# Altium project SmartWatchFinalProject.PrjPcb
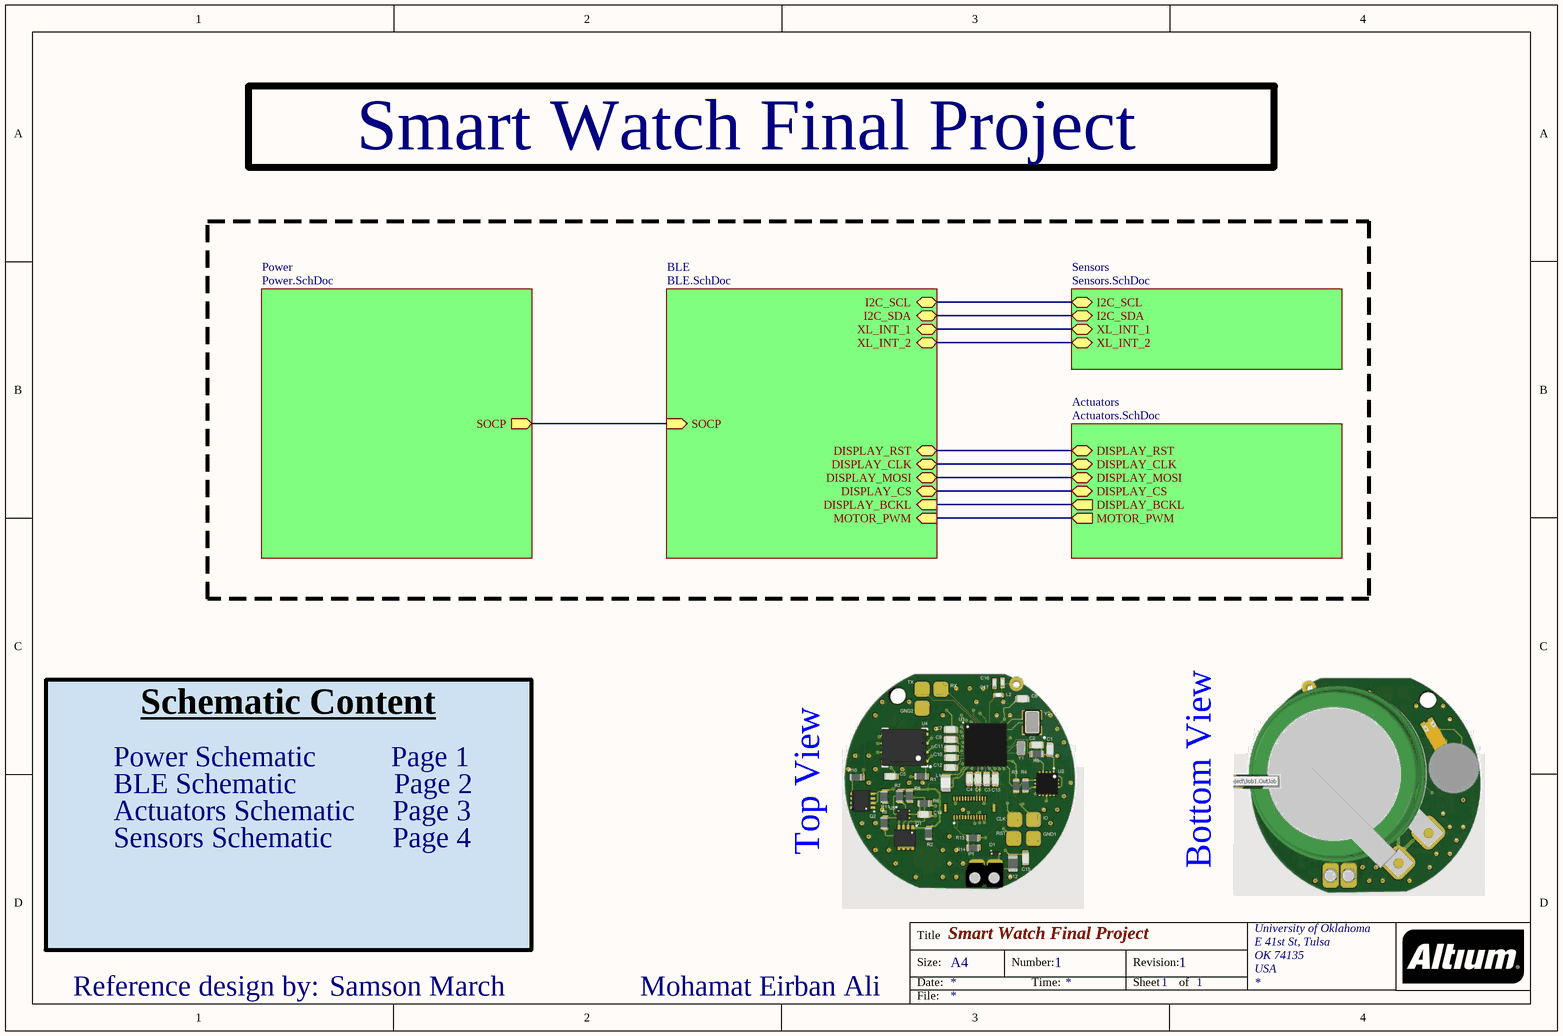
[diagram p0: Main.SchDoc]
Address: 4502 E 41st St; Address12: Tulsa, OK 74135; Author: Mohamat Eirban Ali; DesignStatus: Checked; Organization: University of Oklahoma; Original Designer: Samson March; Project Name12: Smart Watch V5; Project Title: Smart Watch Final Project
5 sheets, 54 parts. Net scope: hierarchical (ports join the sheet entries above them; power ports are global).
Board file: SmartWatchFinalProject.PcbDoc
Sheets:
  Main.SchDoc
    Power = Power.SchDoc
    BLE = BLE.SchDoc
    Sensors = Sensors.SchDoc
    Actuators = Actuators.SchDoc

## Sheet Main.SchDoc: Smart Watch Final Project
size A4; Author: Mohamat Eirban Ali; CompanyName: University of Oklahoma; Organization: University of Oklahoma; Address1: E 41st St, Tulsa; Address2: OK 74135; Address3: USA; DocumentNumber: 1; Revision: 1; SheetNumber: 1; SheetTotal: 1; Project Name: Smart Watch V5; Design Status: Checked

### Sub-sheets
Actuators = Actuators.SchDoc: DISPLAY_RST (bidir), DISPLAY_CLK (bidir), DISPLAY_MOSI (bidir), DISPLAY_CS (bidir), DISPLAY_BCKL (out), MOTOR_PWM (out)
BLE = BLE.SchDoc: SOCP (in), I2C_SCL (bidir), I2C_SDA (bidir), XL_INT_1 (bidir), XL_INT_2 (bidir), DISPLAY_RST (bidir), DISPLAY_CLK (bidir), DISPLAY_MOSI (bidir), DISPLAY_CS (bidir), DISPLAY_BCKL (in), MOTOR_PWM (in)
Power = Power.SchDoc: SOCP (out)
Sensors = Sensors.SchDoc: I2C_SCL (bidir), I2C_SDA (bidir), XL_INT_1 (bidir), XL_INT_2 (bidir)

### Nets
DISPLAY_BCKL: sheet BLE/DISPLAY_BCKL, sheet Actuators/DISPLAY_BCKL
DISPLAY_CLK: sheet BLE/DISPLAY_CLK, sheet Actuators/DISPLAY_CLK
DISPLAY_CS: sheet BLE/DISPLAY_CS, sheet Actuators/DISPLAY_CS
DISPLAY_MOSI: sheet BLE/DISPLAY_MOSI, sheet Actuators/DISPLAY_MOSI
DISPLAY_RST: sheet BLE/DISPLAY_RST, sheet Actuators/DISPLAY_RST
I2C_SCL: sheet BLE/I2C_SCL, sheet Sensors/I2C_SCL
I2C_SDA: sheet BLE/I2C_SDA, sheet Sensors/I2C_SDA
MOTOR_PWM: sheet BLE/MOTOR_PWM, sheet Actuators/MOTOR_PWM
SOCP: sheet Power/SOCP, sheet BLE/SOCP
XL_INT_1: sheet BLE/XL_INT_1, sheet Sensors/XL_INT_1
XL_INT_2: sheet BLE/XL_INT_2, sheet Sensors/XL_INT_2

### Notes on the sheet
- Power Schematic          Page 1
- BLE Schematic             Page 2
- Actuators Schematic     Page 3
- Sensors Schematic        Page 4
- Top View
- Bottom View
- Schematic Content
- Reference design by:
- Title
- Size:
- Date:
- A4
- Number:
- Time:
- Revision:
- Sheet
- of
- File:

## Sheet Power.SchDoc: =Project Title
size A4; Author: Mohamat Eirban Ali; Organization: University of Oklahoma; Address1: 4502 E 41st St; Address2: Tulsa, OK 74135; DocumentNumber: 2; Revision: 1; SheetNumber: 1; SheetTotal: 4
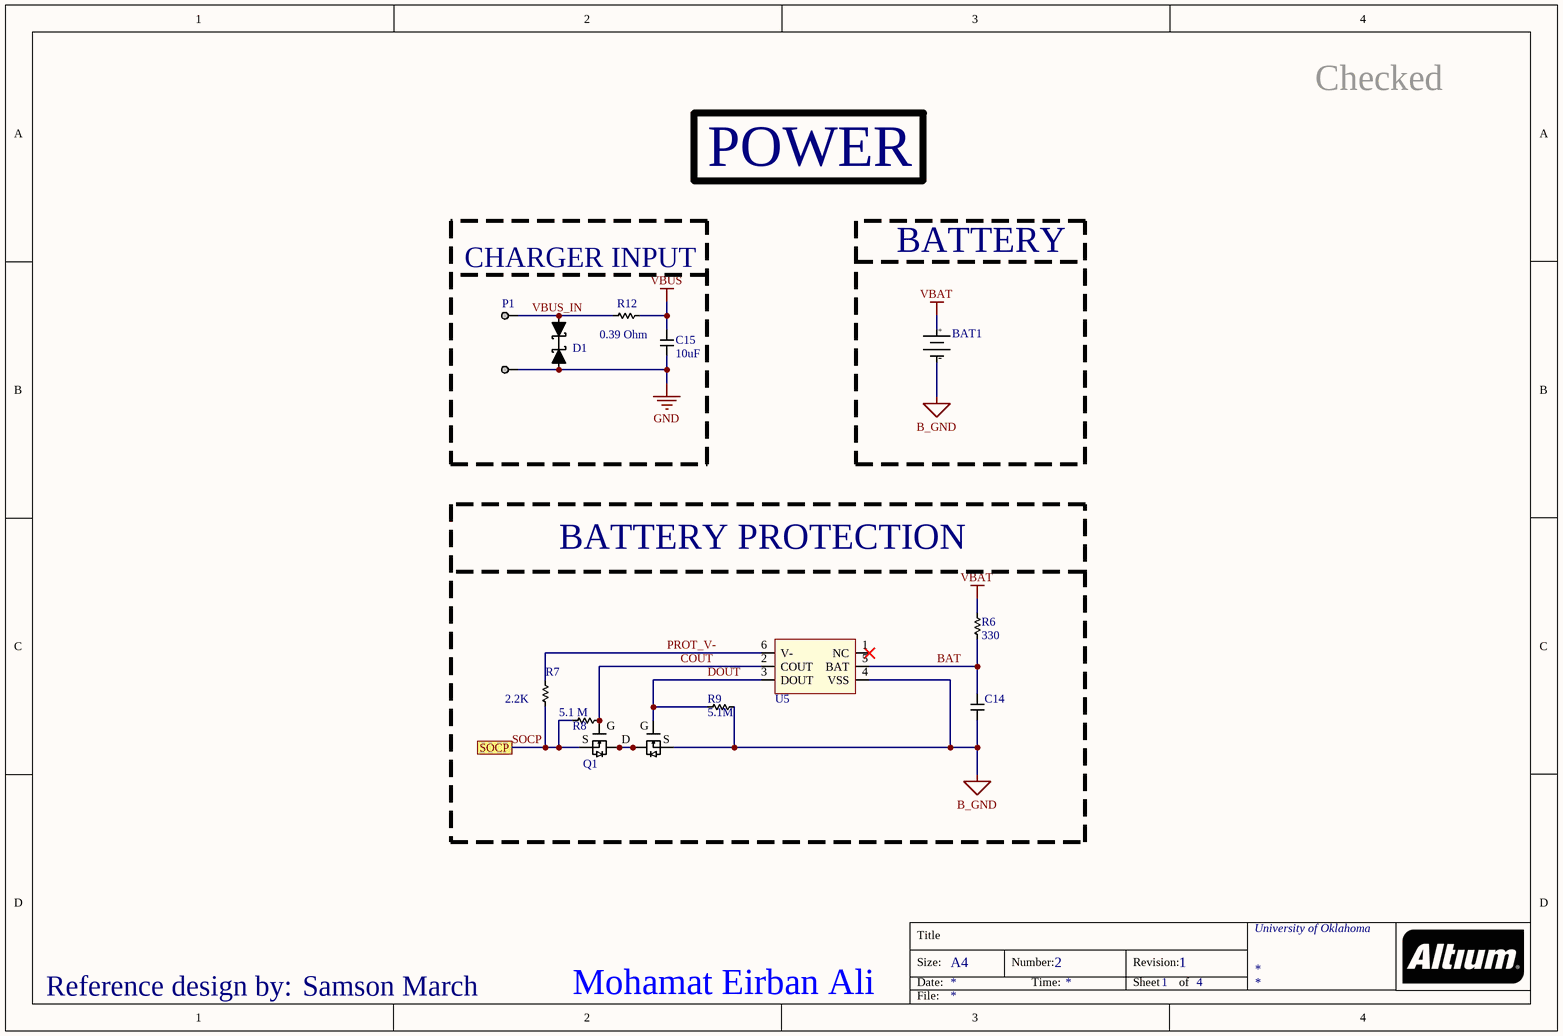
[diagram p1: Power.SchDoc]

### Parts
BAT1  (no value)  [RJD2430C1ST1]
C14  (no value)  [CAP_0603_HIGH]
C15  10uF  [CAP_0603_HIGH]
D1  (no value)  [ESD9B5.0ST5G]
P1  (no value)  [800-10-002-30-507101]
Q1  (no value)  [ECH8693R-TL-W]
R6  330  [RES_0603_HIGH]
R7  2.2K  [RES_0603_HIGH]
R8  5.1 M  [RES_0603_HIGH]
R9  5.1M  [RES_0603_HIGH]
R12  0.39 Ohm  [RES_0805_HIGH]
U5  (no value)  [BQ29700DSER]

### Blocks framed on the sheet
CHARGER INPUT: C15 D1 P1 R12
BATTERY: BAT1
BATTERY PROTECTION: C14 Q1 R6-R9 U5

### Ports
SOCP

### Nets
B_GND: BAT1.2(-) C14.2 Q1.3(S2) R9.1 U5.4(VSS)
GND: C15.2 D1.1 P1.2
VBAT: BAT1.1(+) R6.1
VBUS: C15.1 R12.2
BAT: C14.1 R6.2 U5.5(BAT)
COUT: Q1.2(G1) R8.1 U5.2(COUT)
DOUT: Q1.4(G2) R9.2 U5.3(DOUT)
PROT_V-: R7.1 U5.6(V-)
SOCP: Q1.1(S1) R7.2 R8.2 ; port SOCP
VBUS_IN: D1.2 P1.1 R12.1
NetQ1_5: Q1.5(D) Q1.6(D) Q1.7(D) Q1.8(D)

Not connected (* = marked no-connect by the designer): U5 1(NC)*

### Notes on the sheet
- POWER
- Reference design by:
- Title
- Size:
- Date:
- A4
- Number:
- Time:
- Revision:
- Sheet
- of
- File:
- (in symbol ECH8693R-TL-W) G; S

### Library data of the parts
BAT1 = RJD2430C1ST1: Coin, 24.5mm 3.7V Lithium-Ion Battery Rechargeable (Secondary) 110mAh; Manufacturer 1: CDE Illinois Capacitor; Supplier 1: Digi-Key; Supplier Part Number 1: 1572-1630-ND; Manufacturer Part Number 1: RJD2430C1ST1; Stock 1: 39; Pricing 1: 1=11.09000, 30=8.60200, 60=8.11500, 120=7.68217, 270=7.24941, 510=7.03300 (USD); RoHS: No
C14 = Capacitor_0603: 0603 Capacitor; Manufacturer 1: TDK; Manufacturer Part Number 1: CGA3E2X7R1H104K080AA; Capacitance: 100nF; Tolerance: 10%; Voltage Rating: 50V; Dielectric: X7R; Supplier 1: Digi-Key; Supplier Part Number 1: 445-5666-6-ND; Stock 1: 11655935; Pricing 1: 1=0.10000, 10=0.07500, 100=0.03350, 500=0.02390, 1000=0.01878 (USD); RoHS: Yes; Mount: Surface Mount; Case/Package: 0603; Weight: 7.1E-05oz; Case Code (Imperial): 0603; Case Code (Metric): 1608; Min Operating Temperature: -55°C; Max Operating Temperature: 125°C; Packaging: Tape and Reel; Voltage Rating (DC): 50V; Termination: SMD/SMT; Package Quantity: 1; Voltage: 50V; Composition: Ceramic; Length: 1.6mm; Height: 0.8mm; Width: 0.8mm; Depth: 0.8mm; Thickness: 0.035inch; Ratings: AEC-Q200; Radiation Hardening: No; REACH SVHC: No SVHC; Lead Free: Lead Free; ComponentLink1URL: https://datasheet.ciiva.com/24216/cga3e2x7r1h104k080aa-266291-24216208.pdf?src-supplier=Mouser; ComponentLink1Description: https://datasheet.ciiva.com/24216/cga3e2x7r1h104k080aa-266291-24216208.pdf?src-supplier=Mouser; ComponentLink2URL: https://datasheet.ciiva.com/15192/getdatasheetpartid-715867-15192412.pdf?src-supplier=Verical; ComponentLink2Description: https://datasheet.ciiva.com/15192/getdatasheetpartid-715867-15192412.pdf?src-supplier=Verical; ComponentLink3URL: https://datasheet.ciiva.com/16500/mlccspec-automotive-general-midvoltage-en-16500693.pdf?src-supplier=Future+Electronics; ComponentLink3Description: https://datasheet.ciiva.com/16500/mlccspec-automotive-general-midvoltage-en-16500693.pdf?src-supplier=Future+Electronics; ComponentLink4URL: https://datasheet.ciiva.com/22725/1735392-22725642.pdf?src-supplier=Element14; ComponentLink4Description: https://datasheet.ciiva.com/22725/1735392-22725642.pdf?src-supplier=Element14; ComponentLink5URL: https://datasheet.ciiva.com/23803/1936565-23803084.pdf?src-supplier=Newark; ComponentLink5Description: https://datasheet.ciiva.com/23803/1936565-23803084.pdf?src-supplier=Newark; ComponentLink6URL: https://datasheet.ciiva.com/46385/1735392-46385708.pdf?src-supplier=Element14; ComponentLink6Description: https://datasheet.ciiva.com/46385/1735392-46385708.pdf?src-supplier=Element14
C15 = Capacitor_0603_1: 0603 Capacitor
D1 = ESD9B5.0ST5G: TVS DIODE 5V SOD923; Manufacturer 1: ON Semiconductor; Min Breakdown Voltage: 5.8V; Power Line Protection: No; Clamping Voltage: 12.5V; Peak Pulse Power: 300mW; Capacitance: 15pF; Number of Channels: 1; Peak Pulse Current: 1A; Direction: Bidirectional; Leakage Current: 1uA; Element Configuration: Single; Test Current: 1mA; ESD Protection: Yes; Max Breakdown Voltage: 7.8V; Supplier 1: Digi-Key; Supplier Part Number 1: ESD9B5.0ST5GOSCT-ND; Manufacturer Part Number 1: ESD9B5.0ST5G; Stock 1: 624705; Pricing 1: 1=0.14000, 10=0.13100, 100=0.07120, 500=0.04380, 1000=0.02986 (USD); RoHS: Yes; Case/Package: SOD-923-2; Number of Pins: 2; Contact Plating: Tin; Min Operating Temperature: -55°C; Max Operating Temperature: 150°C; Packaging: Tape and Reel; Reverse Standoff Voltage: 5V; Composition: Zener; Package Quantity: 1; Breakdown Voltage: 5.8V; Termination: SMD/SMT; Operating Supply Voltage: 5V; Max Power Dissipation: 300mW; Working Voltage: 5V; Polarity: Bidirectional; Max Reverse Leakage Current: 1uA; Number of Lines: 1; Reverse Breakdown Voltage: 5.8V; Number of Elements: 1; Number of Bidirectional Channels: 1; Max Surge Current: 1A; Length: 0.8mm; Height: 0.4mm; Depth: 0.6mm; Width: 0.65mm; Radiation Hardening: No; Lead Free: Lead Free; Halogen Free: Halogen Free; REACH SVHC: No SVHC; ComponentLink1URL: https://datasheet.ciiva.com/1219/1596367-1219274.pdf?src-supplier=Newark; ComponentLink1Description: https://datasheet.ciiva.com/1219/1596367-1219274.pdf?src-supplier=Newark; ComponentLink2URL: https://datasheet.ciiva.com/15143/getdatasheetpartid-148214-15143780.pdf?src-supplier=Verical; ComponentLink2Description: https://datasheet.ciiva.com/15143/getdatasheetpartid-148214-15143780.pdf?src-supplier=Verical; ComponentLink3URL: https://datasheet.ciiva.com/3304/esd9b-d-3304010.pdf?src-supplier=Avnet; ComponentLink3Description: https://datasheet.ciiva.com/3304/esd9b-d-3304010.pdf?src-supplier=Avnet; ComponentLink4URL: https://datasheet.ciiva.com/339/esd9b-d-339708.pdf?src-supplier=Digi-Key; ComponentLink4Description: https://datasheet.ciiva.com/339/esd9b-d-339708.pdf?src-supplier=Digi-Key; ComponentLink5URL: https://datasheet.ciiva.com/339/esd9b-d-339707.pdf?src-supplier=Digi-Key; ComponentLink5Description: https://datasheet.ciiva.com/339/esd9b-d-339707.pdf?src-supplier=Digi-Key; ComponentLink6URL: https://datasheet.ciiva.com/4508/esd9b-d-4508620.pdf?src-supplier=Mouser; ComponentLink6Description: https://datasheet.ciiva.com/4508/esd9b-d-4508620.pdf?src-supplier=Mouser
P1 = 800-10-002-30-507101: 2 Position Spring Mating Target Connector Surface Mount; Manufacturer 1: Preci-Dip; Gender: Male; Current Rating: 3.5A; Voltage Rating: 150V; Number of Contacts: 2; Max Voltage Rating (AC): 100V; Pitch: 2.54mm; Supplier 1: Digi-Key; Supplier Part Number 1: 1212-1446-ND; Manufacturer Part Number 1: 800-10-002-30-507101; Stock 1: 803; Pricing 1: 1=0.47000, 10=0.44500, 25=0.40000, 50=0.35560, 100=0.34080, 250=0.31116, 500=0.29634, 1000=0.24448, 2500=0.22226 (USD); RoHS: Yes; Mount: Surface Mount; Contact Material: Brass; Contact Plating: Gold; Material: Brass; Housing Material: Polychlorinated; Housing Color: Black; Min Operating Temperature: -55°C; Max Operating Temperature: 125°C; Number of Rows: 1; Packaging: Bulk; Max Current Rating: 3.5A; Package Quantity: 1710; Termination: Solder; Orientation: Straight; Length: 5.08mm; Height: 4mm; Depth: 2.54mm; ComponentLink1URL: https://datasheet.ciiva.com/11750/0900766b80e0c4e6-11750532.pdf?src-supplier=RSComponents; ComponentLink1Description: https://datasheet.ciiva.com/11750/0900766b80e0c4e6-11750532.pdf?src-supplier=RSComponents; ComponentLink2URL: https://datasheet.ciiva.com/18468/catalog-18468028.pdf?src-supplier=Digi-Key; ComponentLink2Description: https://datasheet.ciiva.com/18468/catalog-18468028.pdf?src-supplier=Digi-Key
Q1 = ECH8693R-TL-W: Mosfet Array 2 N-Channel (Dual) Common Drain 24V 14A 1.4W Surface Mount SOT-28FL/ECH8; Manufacturer 1: ON Semiconductor; Rise Time: 525ns; Rds On Max: 7mR; Turn-On Delay Time: 545ns; Turn-Off Delay Time: 18650ns; Fall Time: 22200ns; Gate to Source Voltage (Vgs): 12.5V; Number of Channels: 2; Supplier 1: Digi-Key; Supplier Part Number 1: ECH8693R-TL-WOSCT-ND; Manufacturer Part Number 1: ECH8693R-TL-W; Stock 1: 2348; Pricing 1: 1=0.58000, 10=0.49500, 100=0.36940, 500=0.29028, 1000=0.22430 (USD); RoHS: Yes; Mount: Surface Mount; Case/Package: SMD/SMT; Number of Pins: 8; Contact Plating: Tin; Min Operating Temperature: -55°C; Max Operating Temperature: 150°C; Packaging: Tape and Reel; Drain to Source Voltage (Vdss): 24V; Continuous Drain Current (ID): 14A; Max Power Dissipation: 1.4W; Drain to Source Breakdown Voltage: 24V; Drain to Source Resistance: 7mR; Package Quantity: 3000; FET Type: 2 N-Channel; Radiation Hardening: No; Lead Free: Lead Free; ComponentLink1URL: https://datasheet.ciiva.com/30022/ech8693r-d-30022230.pdf?src-supplier=Avnet; ComponentLink1Description: https://datasheet.ciiva.com/30022/ech8693r-d-30022230.pdf?src-supplier=Avnet
R6 = Resistor_0603_2: 0603 Resistor
R7 = Resistor_0603_1: 0603 Resistor
R8 R9 = Resistor_0603: 0603 Resistor; Manufacturer 1: Panasonic; Manufacturer Part Number 1: ERJ3GEYJ515V; Resistance: 5.1MR; Tolerance: 5%; Temperature Coefficient: 150ppm/°C; Power Rating: 100mW; Voltage Rating: 75V; Voltage Rating (DC): 50V; Supplier 1: Digi-Key; Supplier Part Number 1: P5.1MGCT-ND; Stock 1: 168591; Pricing 1: 1=0.10000, 10=0.04300, 100=0.01760, 1000=0.00791, 2500=0.00686 (USD); RoHS: Yes; Mount: Surface Mount; Case/Package: 0603; Case Code (Metric): 1608; Case Code (Imperial): 0603; Contact Plating: Tin; Min Operating Temperature: -55°C; Max Operating Temperature: 155°C; Packaging: Tape and Reel; Composition: Thick Film; Number of Terminations: 2; Max Power Dissipation: 100mW; Package Quantity: 1; Termination: SMD/SMT; Features: Automotive AEC-Q200; Military Standard: Not; Length: 1.6mm; Height: 0.45mm; Width: 0.031inch; Depth: 0.8mm; Lead Free: Lead Free; REACH SVHC: No SVHC; ComponentLink1URL: https://datasheet.ciiva.com/24072/aoa0000ce1-37422-24072359.pdf?src-supplier=Mouser; ComponentLink1Description: https://datasheet.ciiva.com/24072/aoa0000ce1-37422-24072359.pdf?src-supplier=Mouser; ComponentLink2URL: https://datasheet.ciiva.com/9195/aoa0000ce1-9195547.pdf?src-supplier=Avnet; ComponentLink2Description: https://datasheet.ciiva.com/9195/aoa0000ce1-9195547.pdf?src-supplier=Avnet; ComponentLink3URL: https://datasheet.ciiva.com/43460/1500035-43460797.pdf?src-supplier=Farnell; ComponentLink3Description: https://datasheet.ciiva.com/43460/1500035-43460797.pdf?src-supplier=Farnell; ComponentLink4URL: https://datasheet.ciiva.com/46448/1500035-46448447.pdf?src-supplier=Element14; ComponentLink4Description: https://datasheet.ciiva.com/46448/1500035-46448447.pdf?src-supplier=Element14
R12 = Resistor_0805: 0805 Resistor
U5 = BQ29700DSER: Battery Battery Protection IC Lithium-Ion/Polymer 6-WSON (1.5x1.5); Manufacturer 1: Texas Instruments; Number of Cells: 1; Fault Protection: Over Current; Operating Supply Voltage: 8V; Supplier 1: Digi-Key; Supplier Part Number 1: 296-43985-1-ND; Manufacturer Part Number 1: BQ29700DSER; Stock 1: 54841; Pricing 1: 1=0.69000, 10=0.60800, 100=0.46650, 500=0.36874, 1000=0.29499 (USD); RoHS: Yes; Mount: Surface Mount; Number of Pins: 6; Weight: 0.000342oz; Contact Plating: Gold; Min Operating Temperature: -40°C; Max Operating Temperature: 85°C; Packaging: Tape and Reel; Package Quantity: 3000; Lead Free: Lead Free; ComponentLink1URL: http://www.ti.com/general/docs/lit/getliterature.tsp?genericPartNumber=BQ2970&amp;&amp;fileType=pdf&src-supplier=Avnet+Asia; ComponentLink1Description: http://www.ti.com/general/docs/lit/getliterature.tsp?genericPartNumber=BQ2970&amp;&amp;fileType=pdf&src-supplier=Avnet+Asia; ComponentLink2URL: http://www.ti.com/general/docs/lit/getliterature.tsp?genericPartNumber=BQ2970&&fileType=pdf&src-supplier=Avnet; ComponentLink2Description: http://www.ti.com/general/docs/lit/getliterature.tsp?genericPartNumber=BQ2970&&fileType=pdf&src-supplier=Avnet; ComponentLink3URL: http://www.ti.com/lit/gpn/bq2970?src-supplier=Mouser; ComponentLink3Description: http://www.ti.com/lit/gpn/bq2970?src-supplier=Mouser; ComponentLink4URL: http://www.ti.com/lit/ds/symlink/bq2971.pdf?src-supplier=Digi-Key; ComponentLink4Description: http://www.ti.com/lit/ds/symlink/bq2971.pdf?src-supplier=Digi-Key

## Sheet BLE.SchDoc: =Project Title
size A4; Organization: University of Oklahoma; Address1: 4502 E 41st St; Address2: Tulsa, OK 74135; DocumentNumber: 3; Revision: 1; SheetNumber: 2; SheetTotal: 4
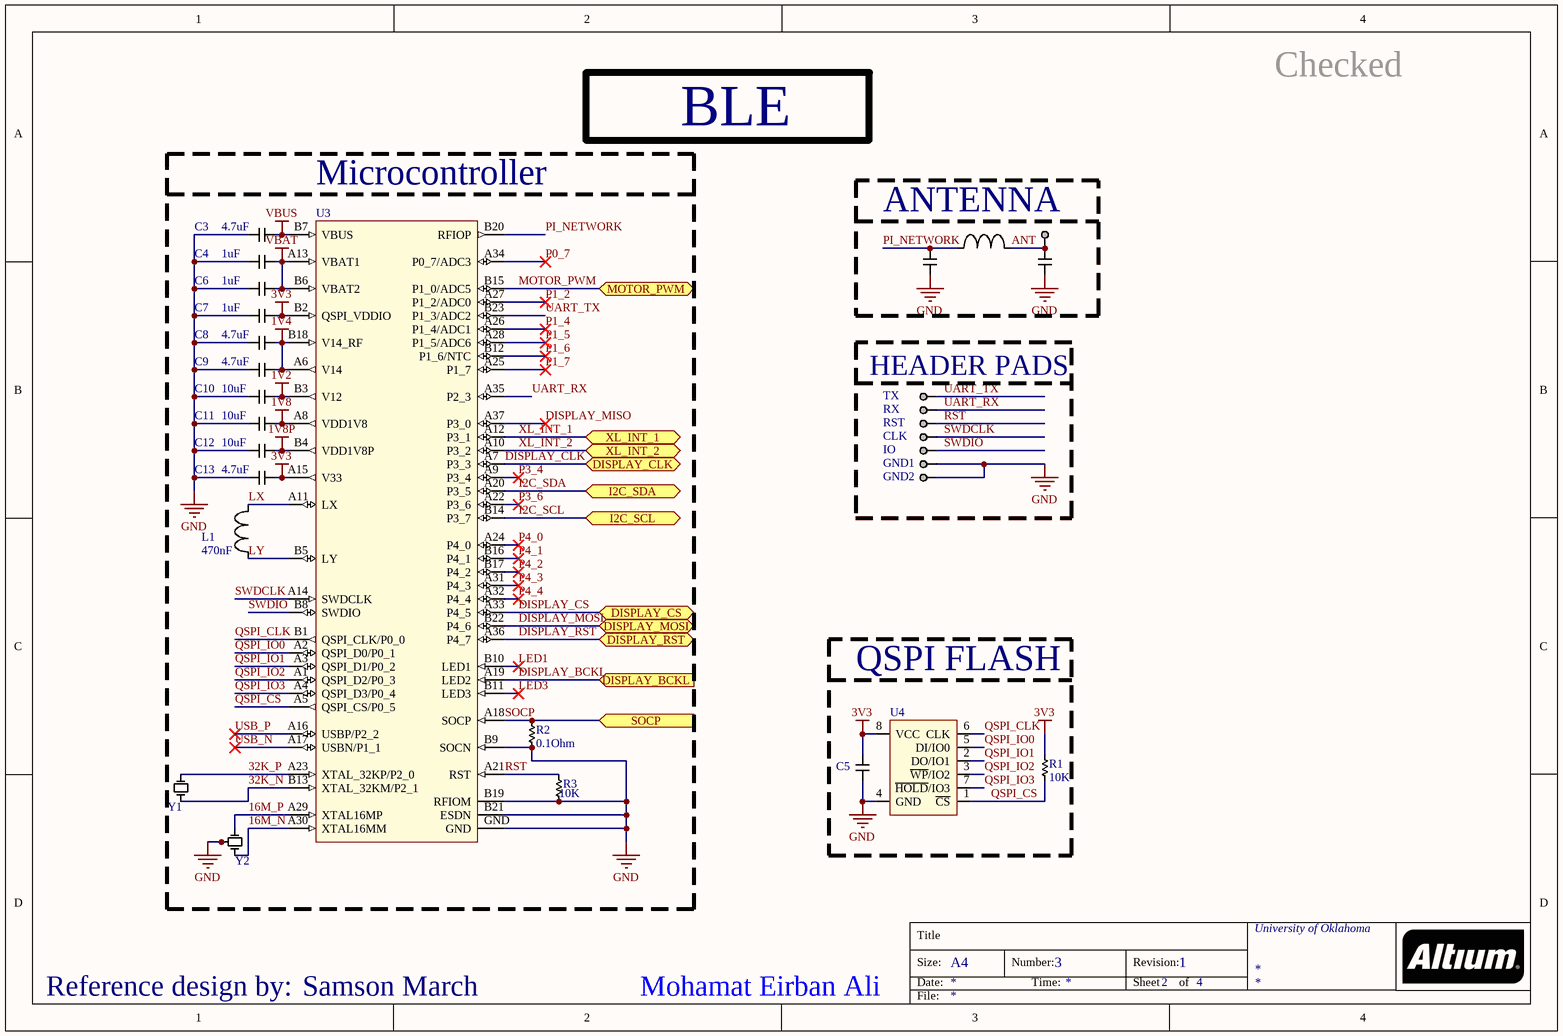
[diagram p2: BLE.SchDoc]

### Parts
ANT1  (no value)  [0.1" Header]  (no BOM)
C3  4.7uF  [CAP_0603_HIGH]
C4  1uF  [CAP_0603_HIGH]
C5  (no value)  [CAP_0603_HIGH]
C6  1uF  [CAP_0603_HIGH]
C7  1uF  [CAP_0603_HIGH]
C8  4.7uF  [CAP_0603_HIGH]
C9  4.7uF  [CAP_0603_HIGH]
C10  10uF  [CAP_0603_HIGH]
C11  10uF  [CAP_0603_HIGH]
C12  10uF  [CAP_0603_HIGH]
C13  4.7uF  [CAP_0603_HIGH]
C16  (no value)  [CAP_0402_MEDIUM]  (no BOM)
C17  (no value)  [CAP_0402_MEDIUM]  (no BOM)
CLK  (no value)  [0.1" Pad]  (no BOM)
GND1  (no value)  [0.1" Pad]  (no BOM)
GND2  (no value)  [0.1" Pad]  (no BOM)
IO  (no value)  [0.1" Pad]  (no BOM)
L1  value 470nF  [IND_0805_HIGH]
L2  (no value)  [IND_0402_MEDIUM]  (no BOM)
R1  10K  [RES_0603_HIGH]
R2  0.1Ohm  [RES_0603_HIGH]
R3  10K  [RES_0603_HIGH]
RST  (no value)  [0.1" Pad]  (no BOM)
RX  (no value)  [0.1" Pad]  (no BOM)
TX  (no value)  [0.1" Pad]  (no BOM)
U3  (no value)  [DA14683]
U4  (no value)  [W25Q128JVPIQ]
Y1  (no value)  [9HT11-32.768KDZB-T]
Y2  (no value)  [7M-16.000MEEQ-T]

### Blocks framed on the sheet
BLE: C3 C4 C6-C13 L1 R2 R3 U3 Y1 Y2
ANTENNA: ANT1 C16 C17 L2
HEADER PADS: CLK GND1 GND2 IO RST RX TX
QSPI FLASH: C5 R1 U4

### Ports
DISPLAY_BCKL (in), DISPLAY_CLK (bidir), DISPLAY_CS (bidir), DISPLAY_MOSI (bidir), DISPLAY_RST (bidir), I2C_SCL (bidir), I2C_SDA (bidir), MOTOR_PWM (bidir), SOCP (in), XL_INT_1 (bidir), XL_INT_2 (bidir)

### Nets
1V2: C10.1 U3.B3(V12)
1V4: C8.1 C9.1 U3.A6(V14) U3.B18(V14_RF)
1V8: C11.1 U3.A8(VDD1V8)
1V8P: C12.1 U3.B4(VDD1V8P)
3V3: C5.1 C7.1 C13.1 R1.2 U3.A15(V33) U3.B2(QSPI_VDDIO) U4.8(VCC)
GND: C3.2 C4.2 C5.2 C6.2 C7.2 C8.2 C9.2 C10.2 C11.2 C12.2 C13.2 C16.1 C17.1 GND1.1 GND2.1 R2.1 R3.1 U3.B9(SOCN) U3.B19(RFIOM) U3.B21(ESDN) U3.GND U4.4(GND) Y2.2 Y2.4
VBAT: C4.1 C6.1 U3.A13(VBAT1) U3.B6(VBAT2)
VBUS: C3.1 U3.B7(VBUS)
16M_N: U3.A30(XTAL16MM) Y2.3
16M_P: U3.A29(XTAL16MP) Y2.1
32K_N: U3.B13(XTAL_32KM/P2_1) Y1.1
32K_P: U3.A23(XTAL_32KP/P2_0) Y1.2
ANT: ANT1.1 C17.2 L2.1
DISPLAY_BCKL: U3.A19(LED2) ; port DISPLAY_BCKL
DISPLAY_CLK: U3.A7(P3_3) ; port DISPLAY_CLK
DISPLAY_CS: U3.A33(P4_5) ; port DISPLAY_CS
DISPLAY_MISO: U3.A37(P3_0)
DISPLAY_MOSI: U3.B22(P4_6) ; port DISPLAY_MOSI
DISPLAY_RST: U3.A36(P4_7) ; port DISPLAY_RST
I2C_SCL: U3.B14(P3_7) ; port I2C_SCL
I2C_SDA: U3.A20(P3_5) ; port I2C_SDA
LED1: U3.B10(LED1)
LED3: U3.B11(LED3)
LX: L1.2 U3.A11(LX)
LY: L1.1 U3.B5(LY)
MOTOR_PWM: U3.B15(P1_0/ADC5) ; port MOTOR_PWM
P0_7: U3.A34(P0_7/ADC3)
P1_2: U3.A27(P1_2/ADC0)
P1_4: U3.A26(P1_4/ADC1)
P1_5: U3.A28(P1_5/ADC6)
P1_6: U3.B12(P1_6/NTC)
P1_7: U3.A25(P1_7)
P3_4: U3.A9(P3_4)
P3_6: U3.A22(P3_6)
P4_0: U3.A24(P4_0)
P4_1: U3.B16(P4_1)
P4_2: U3.B17(P4_2)
P4_3: U3.A31(P4_3)
P4_4: U3.A32(P4_4)
PI_NETWORK: C16.2 L2.2 U3.B20(RFIOP)
QSPI_CLK: U3.B1(QSPI_CLK/P0_0) U4.6(CLK)
QSPI_CS: R1.1 U3.A5(QSPI_CS/P0_5) U4.1(~{CS})
QSPI_IO0: U3.A2(QSPI_D0/P0_1) U4.5(DI/IO0)
QSPI_IO1: U3.A3(QSPI_D1/P0_2) U4.2(DO/IO1)
QSPI_IO2: U3.A1(QSPI_D2/P0_3) U4.3(~{WP}/IO2)
QSPI_IO3: U3.A4(QSPI_D3/P0_4) U4.7(~{HOLD}/IO3)
RST: R3.2 RST.1 U3.A21(RST)
SOCP: R2.2 U3.A18(SOCP) ; port SOCP
SWDCLK: CLK.1 U3.A14(SWDCLK)
SWDIO: IO.1 U3.B8(SWDIO)
UART_RX: RX.1 U3.A35(P2_3)
UART_TX: TX.1 U3.B23(P1_3/ADC2)
USB_N: U3.A17(USBN/P1_1)
USB_P: U3.A16(USBP/P2_2)
XL_INT_1: U3.A12(P3_1) ; port XL_INT_1
XL_INT_2: U3.A10(P3_2) ; port XL_INT_2

### Notes on the sheet
- Microcontroller
- Reference design by:
- Mohamat Eirban Ali
- Title
- Size:
- Date:
- A4
- Number:
- Time:
- Revision:
- Sheet
- of
- File:

### Library data of the parts
ANT1 = 0.1" Header
C3 C8 C9 C13 = Capacitor_0603_2: 0603 Capacitor
C4 C6 C7 = Capacitor_0603_3: 0603 Capacitor
C5 = Capacitor_0603: 0603 Capacitor
C10-C12 = Capacitor_0603_1: 0603 Capacitor
C16 C17 = Capacitor_0402: 0402 Capacitor
CLK GND1 GND2 IO RST RX TX = 0.1" Pad
L1 = Inductor_0805: Parameter 1: CKP2012; Parameter 2: NR47M-T; Parameter 3: *; Parameter 4: *
L2 = Inductor_0402
R1 R3 = Resistor_0603_3: 0603 Resistor
R2 = Resistor_0603_4: 0603 Resistor
U3 = DA14683: SmartBond DA14683 Single-chip high-security Bluetooth 5 solution with expandable memory; Manufacturer 1: Dialog Semiconductor; Manufacturer Part Number 1: DA14683-00000A92; Supplier 1: Digi-Key; Supplier Part Number 1: DA14683-00000A92CT-ND; Stock 1: 3880; Pricing 1: 1=5.12000, 10=4.57400, 25=4.11680, 100=3.75090, 250=3.38496, 500=3.03730, 1000=2.56158 (USD); RoHS: No
U4 = W25Q128JVPIQ: FLASH - NOR Memory IC 128Mb (16M x 8) SPI - Quad I/O, QPI, DTR 133MHz  8-WSON (6x5)
Y1 = 9HT11-32.768KDZB-T: 32.768kHz ±20ppm Crystal 6pF 90 kOhms 2-SMD, No Lead; Parameter 1: 9HT11; Parameter 2: -32.76; Parameter 3: 8KDZ; Parameter 4: B-T
Y2 = 7M-16.000MEEQ-T: 16MHz ±10ppm Crystal 10pF 80 Ohms 4-SMD, No Lead; Parameter 1: 7M-16; Parameter 2: .000M; Parameter 3: EEQ-T

## Sheet Sensors.SchDoc: =Project Title
size A4; Author: Mohamat Eirban Ali; Organization: University of Oklahoma; Address1: 4502 E 41st St; Address2: Tulsa, OK 74135; DocumentNumber: 5; Revision: 1; SheetNumber: 4; SheetTotal: 4
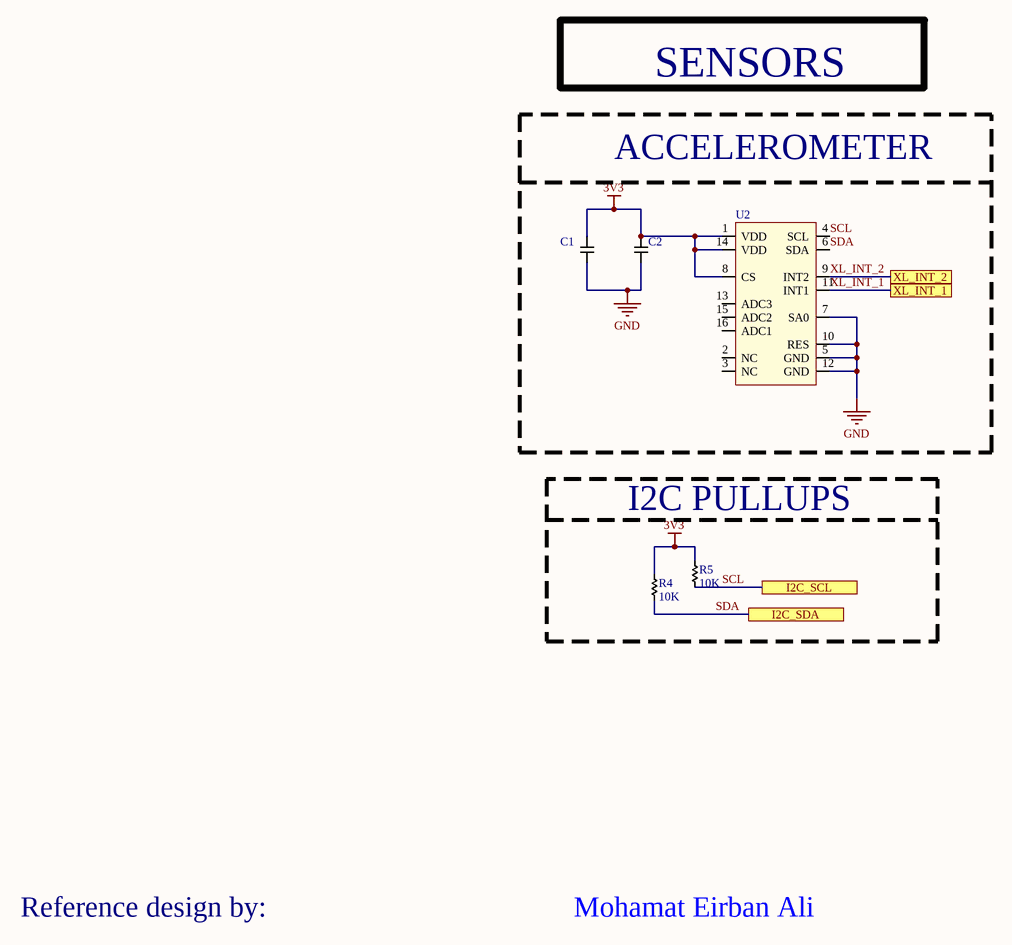
[diagram p3: Sensors.SchDoc]

### Parts
C1  (no value)  [CAP_0603_HIGH]
C2  (no value)  [CAP_0603_HIGH]
R4  10K  [RES_0603_HIGH]
R5  10K  [RES_0603_HIGH]
U2  (no value)  [LIS3DH]

### Blocks framed on the sheet
ACCELEROMETER: C1 C2 U2
I2C PULLUPS: R4 R5

### Ports
I2C_SCL, I2C_SDA, XL_INT_1, XL_INT_2

### Nets
3V3: C1.1 C2.1 R4.2 R5.2 U2.1(VDD) U2.8(CS) U2.14(VDD)
GND: C1.2 C2.2 U2.5(GND) U2.7(SA0) U2.10(RES) U2.12(GND)
SCL: R5.1 U2.4(SCL) ; port I2C_SCL  [project net I2C_SCL]
SDA: R4.1 U2.6(SDA) ; port I2C_SDA  [project net I2C_SDA]
XL_INT_1: U2.11(INT1) ; port XL_INT_1
XL_INT_2: U2.9(INT2) ; port XL_INT_2

Not connected (* = marked no-connect by the designer): U2 2(NC) 3(NC) 13(ADC3) 15(ADC2) 16(ADC1)

### Notes on the sheet
- SENSORS
- Reference design by:
- Mohamat Eirban Ali
- Title
- Size:
- Date:
- A4
- Number:
- Time:
- Revision:
- Sheet
- of
- File:

### Library data of the parts
C1 = Capacitor_0603: 0603 Capacitor; Manufacturer 1: Kyocera AVX; Manufacturer Part Number 1: F980J107MMAAXE; Capacitance: 100uF; Voltage Rating: 6.3V; ESR (Equivalent Series Resistance): 10R; Tolerance: 20%; Supplier 1: Digi-Key; Supplier Part Number 1: 478-9836-1-ND; Stock 1: 15476; Pricing 1: 1=0.67000, 10=0.49100, 100=0.33670, 500=0.26658, 1000=0.22448 (USD); RoHS: Yes; Mount: Surface Mount; Case/Package: 0603; Case Code (Metric): 1608; Case Code (Imperial): 0603; Min Operating Temperature: -55°C; Max Operating Temperature: 125°C; Packaging: Tape and Reel; Length: 0.063inch; Width: 0.033inch; Height - Seated (Max): 0.035inch; ComponentLink1URL: http://www.farnell.com/datasheets/2602422.pdf?src-supplier=Farnell; ComponentLink1Description: http://www.farnell.com/datasheets/2602422.pdf?src-supplier=Farnell; ComponentLink2URL: http://datasheets.avx.com/F98.pdf?src-supplier=Digi-Key; ComponentLink2Description: http://datasheets.avx.com/F98.pdf?src-supplier=Digi-Key
C2 = Capacitor_0603: 0603 Capacitor; Manufacturer 1: Murata; Manufacturer Part Number 1: GRM188R60J106ME47D; Material: Ceramic; Capacitance: 10uF; Tolerance: 20%; Voltage Rating: 6.3V; Dielectric: X5R; Supplier 1: Digi-Key; Supplier Part Number 1: 490-3896-1-ND; Stock 1: 20724673; Pricing 1: 1=0.37000, 10=0.25900, 100=0.15530, 500=0.11644, 1000=0.09833 (USD); RoHS: Yes; Mount: Surface Mount; Case/Package: 0603; Case Code (Metric): 1608; Case Code (Imperial): 0603; Min Operating Temperature: -55°C; Max Operating Temperature: 85°C; Packaging: Tape and Reel; Voltage Rating (DC): 6.3V; Package Quantity: 4000; Termination: SMD/SMT; Voltage: 6.3V; Length: 1.6mm; Height: 0.8mm; Width: 0.031inch; Depth: 0.8mm; Thickness: 0.035inch; Radiation Hardening: No; Lead Free: Lead Free; REACH SVHC: No SVHC; ComponentLink1URL: https://datasheet.ciiva.com/22776/1747457-22776418.pdf?src-supplier=Farnell; ComponentLink1Description: https://datasheet.ciiva.com/22776/1747457-22776418.pdf?src-supplier=Farnell; ComponentLink2URL: https://datasheet.ciiva.com/3777/10175grm188r60j106me4723-3777268.pdf?src-supplier=Arrow; ComponentLink2Description: https://datasheet.ciiva.com/3777/10175grm188r60j106me4723-3777268.pdf?src-supplier=Arrow; ComponentLink3URL: https://datasheet.ciiva.com/28584/415295-28584232.pdf?src-supplier=Element14; ComponentLink3Description: https://datasheet.ciiva.com/28584/415295-28584232.pdf?src-supplier=Element14; ComponentLink4URL: https://datasheet.ciiva.com/29202/450781-da-01-de-vs-chip-kond-0603-10-0-uf-20pr-6-3v-x5r-29202806.pdf?src-supplier=Conrad; ComponentLink4Description: https://datasheet.ciiva.com/29202/450781-da-01-de-vs-chip-kond-0603-10-0-uf-20pr-6-3v-x5r-29202806.pdf?src-supplier=Conrad; ComponentLink5URL: https://datasheet.ciiva.com/29199/454401-da-01-en-vs-kondensator-0603-29199677.pdf?src-supplier=Conrad; ComponentLink5Description: https://datasheet.ciiva.com/29199/454401-da-01-en-vs-kondensator-0603-29199677.pdf?src-supplier=Conrad; ComponentLink6URL: https://datasheet.ciiva.com/16373/l0005e-16373580.pdf?src-supplier=Future+Electronics; ComponentLink6Description: https://datasheet.ciiva.com/16373/l0005e-16373580.pdf?src-supplier=Future+Electronics; ComponentLink7URL: https://datasheet.ciiva.com/138/partnumbering-e-01-138658.pdf?src-supplier=Digi-Key; ComponentLink7Description: https://datasheet.ciiva.com/138/partnumbering-e-01-138658.pdf?src-supplier=Digi-Key; ComponentLink8URL: https://datasheet.ciiva.com/138/partnumbering-e-01-138659.pdf?src-supplier=Digi-Key; ComponentLink8Description: https://datasheet.ciiva.com/138/partnumbering-e-01-138659.pdf?src-supplier=Digi-Key; ComponentLink9URL: https://datasheet.ciiva.com/138/partnumbering-e-01-138660.pdf?src-supplier=Digi-Key; ComponentLink9Description: https://datasheet.ciiva.com/138/partnumbering-e-01-138660.pdf?src-supplier=Digi-Key; ComponentLink10URL: https://datasheet.ciiva.com/14116/grmseries-highdielectrictype-eng-14116428.pdf?src-supplier=Distrelec; ComponentLink10Description: https://datasheet.ciiva.com/14116/grmseries-highdielectrictype-eng-14116428.pdf?src-supplier=Distrelec
R4 R5 = Resistor_0603_3: 0603 Resistor
U2 = LIS3DH: LIS3DH ACCEL 2-16G I2C/SPI 16LGA

## Sheet Actuators.SchDoc: =Project Title
size A4; Author: Mohamat Eirban Ali; Organization: University of Oklahoma; Address1: 4502 E 41st St; Address2: Tulsa, OK 74135; DocumentNumber: 4; Revision: 1; SheetNumber: 3; SheetTotal: 4
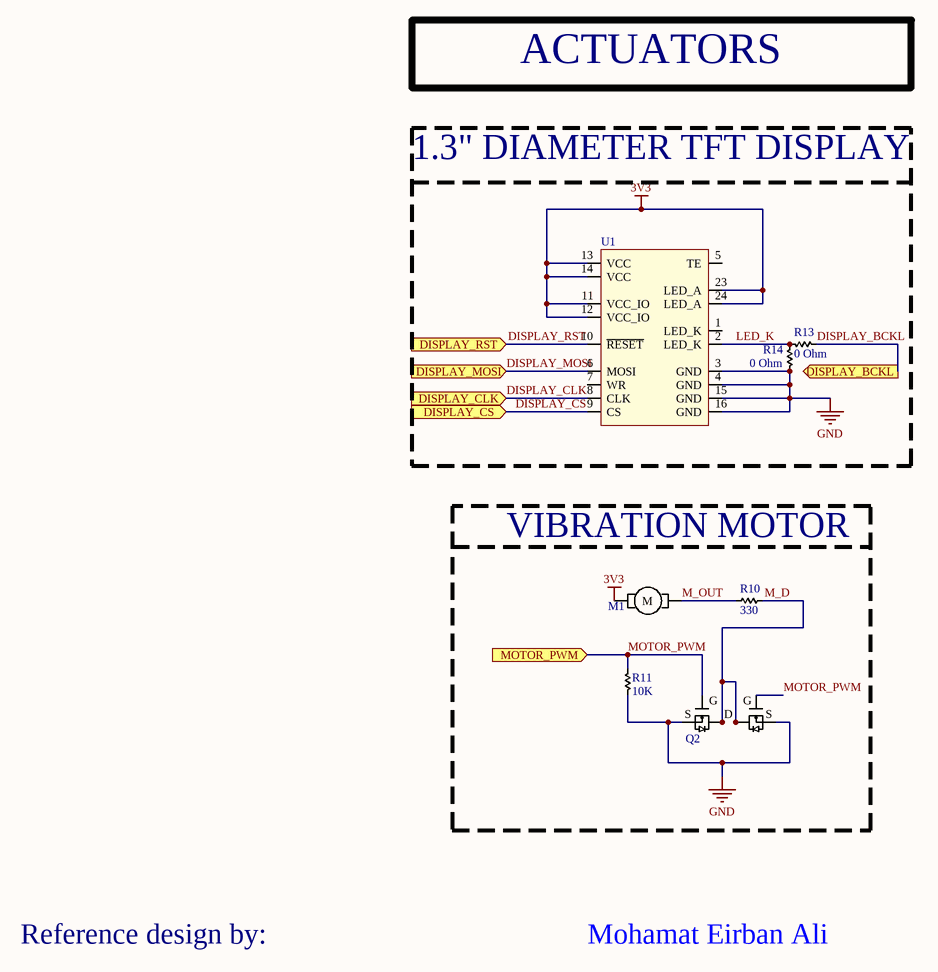
[diagram p4: Actuators.SchDoc]

### Parts
M1  (no value)  [C0720B001F]
Q2  (no value)  [ECH8693R-TL-W]
R10  330  [RES_0603_HIGH]
R11  10K  [RES_0603_HIGH]
R13  0 Ohm  [RES_0603_HIGH]
R14  0 Ohm  [RES_0603_HIGH]
U1  (no value)  [AML130A2402A]

### Blocks framed on the sheet
1.3" DIAMETER TFT DISPLAY: R13 R14 U1
VIBRATION MOTOR: M1 Q2 R10 R11

### Ports
DISPLAY_BCKL (out), DISPLAY_CLK (in), DISPLAY_CS (in), DISPLAY_MOSI (in), DISPLAY_RST (in), MOTOR_PWM (in)

### Nets
3V3: M1.1 U1.11(VCC_IO) U1.12(VCC_IO) U1.13(VCC) U1.14(VCC) U1.23(LED_A) U1.24(LED_A)
GND: Q2.1(S1) Q2.3(S2) R11.1 R14.2 U1.3(GND) U1.4(GND) U1.15(GND) U1.16(GND)
DISPLAY_BCKL: R13.1 ; port DISPLAY_BCKL
DISPLAY_CLK: U1.8(CLK) ; port DISPLAY_CLK
DISPLAY_CS: U1.9(CS) ; port DISPLAY_CS
DISPLAY_MOSI: U1.6(MOSI) ; port DISPLAY_MOSI
DISPLAY_RST: U1.10(~{RESET}) ; port DISPLAY_RST
LED_K: R13.2 R14.1 U1.2(LED_K)
M_D: Q2.5(D) Q2.6(D) Q2.7(D) Q2.8(D) R10.2
M_OUT: M1.2 R10.1
MOTOR_PWM: Q2.2(G1) Q2.4(G2) R11.2 ; port MOTOR_PWM

Not connected (* = marked no-connect by the designer): U1 1(LED_K) 5(TE) 7(WR)

### Notes on the sheet
- ACTUATORS
- Reference design by:
- Mohamat Eirban Ali
- Title
- Size:
- Date:
- A4
- Number:
- Time:
- Revision:
- Sheet
- of
- File:
- (in symbol C0720B001F) M
- (in symbol ECH8693R-TL-W) G; S

### Library data of the parts
M1 = C0720B001F: DC Motor Vibration, ERM 10000 RPM 3VDC; Manufacturer 1: Jinlong Machinery & Electronics; Manufacturer Part Number 1: Z4FC1B1301781; Supplier 1: Digi-Key; Supplier Part Number 1: 1670-1011-1-ND; Stock 1: 12491; Pricing 1: 1=3.49000, 5=3.30200, 10=3.21000, 25=3.11840, 50=2.84300, 100=2.56800, 250=2.47624, 500=2.43956 (USD); RoHS: Yes; Min Operating Temperature: -20°C; Max Operating Temperature: 70°C; Termination: SMD/SMT; RPM: 10000RPM; ComponentLink1URL: http://www.vibration-motor.com/products/download/Z4FC1B1301781.pdf?src-supplier=Digi-Key; ComponentLink1Description: http://www.vibration-motor.com/products/download/Z4FC1B1301781.pdf?src-supplier=Digi-Key
Q2 = ECH8693R-TL-W: as Q1 on sheet Power; Supplier 1: Digi-Key; Supplier Part Number 1: ECH8693R-TL-WOSCT-ND; Manufacturer Part Number 1: ECH8693R-TL-W; Stock 1: 2348; Pricing 1: 1=0.58000, 10=0.49500, 100=0.36940, 500=0.29028, 1000=0.22430 (USD); RoHS: Yes; Mount: Surface Mount; Case/Package: SMD/SMT; Number of Pins: 8; Contact Plating: Tin; Min Operating Temperature: -55°C; Max Operating Temperature: 150°C; Packaging: Tape and Reel; Drain to Source Voltage (Vdss): 24V; Continuous Drain Current (ID): 14A; Max Power Dissipation: 1.4W; Drain to Source Breakdown Voltage: 24V; Drain to Source Resistance: 7mR; Package Quantity: 3000; FET Type: 2 N-Channel; Radiation Hardening: No; Lead Free: Lead Free; ComponentLink1URL: https://datasheet.ciiva.com/30022/ech8693r-d-30022230.pdf?src-supplier=Avnet; ComponentLink1Description: https://datasheet.ciiva.com/30022/ech8693r-d-30022230.pdf?src-supplier=Avnet
R10 = Resistor_0603_2: 0603 Resistor
R11 = Resistor_0603_3: 0603 Resistor
R13 R14 = Resistor_0603_5: 0603 Resistor
U1 = AML130A2402A: AML130A2402A Round 1.3" TFT Display

## Nets that join several sheets
3V3: BLE (7 pins), Sensors (7 pins), Actuators (7 pins)
GND: Power (C15.2 D1.1 P1.2), BLE (24 pins), Sensors (6 pins), Actuators (8 pins)
VBAT: Power (BAT1.1 R6.1), BLE (C4.1 C6.1 U3.A13 U3.B6)
VBUS: Power (C15.1 R12.2), BLE (C3.1 U3.B7)
DISPLAY_BCKL: BLE (U3.A19), Actuators (R13.1)
DISPLAY_CLK: BLE (U3.A7), Actuators (U1.8)
DISPLAY_CS: BLE (U3.A33), Actuators (U1.9)
DISPLAY_MOSI: BLE (U3.B22), Actuators (U1.6)
DISPLAY_RST: BLE (U3.A36), Actuators (U1.10)
I2C_SCL: BLE (U3.B14), Sensors (R5.1 U2.4)
I2C_SDA: BLE (U3.A20), Sensors (R4.1 U2.6)
MOTOR_PWM: BLE (U3.B15), Actuators (Q2.2 Q2.4 R11.2)
SOCP: Power (Q1.1 R7.2 R8.2), BLE (R2.2 U3.A18)
XL_INT_1: BLE (U3.A12), Sensors (U2.11)
XL_INT_2: BLE (U3.A10), Sensors (U2.9)